# Altium schematic sheet MonitorOut.SchDoc
size A
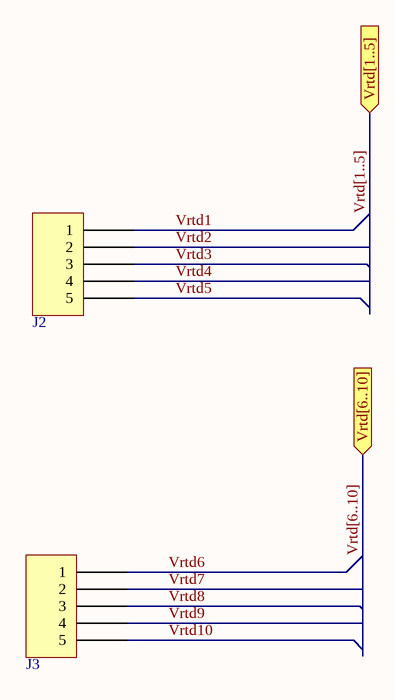
[diagram p0: MonitorOut.SchDoc]

## Parts
J2  0022272051  [MOLEX KK 0022272051]  (value not drawn)
J3  0022272051  [MOLEX KK 0022272051]  (value not drawn)

## Ports
Vrtd[1..5] (in), Vrtd[6..10] (in)

## Nets
Vrtd1: J2.1  [also labelled Vrtd[1..5]]
Vrtd2: J2.2
Vrtd3: J2.3
Vrtd4: J2.4
Vrtd5: J2.5
Vrtd6: J3.1  [also labelled Vrtd[6..10]]
Vrtd7: J3.2
Vrtd8: J3.3
Vrtd9: J3.4
Vrtd10: J3.5

## Library data of the parts
J2 J3 = 0022272051: CONN HEADER 5POS .100 VERT TIN; Manufacturer: Molex, LLC; Pitch: 0.100" (2.54mm); Number Of Positions: 5; Part Number: 0022272051; PartId: 9722; Supplier 1: Digi-Key; Supplier Part Number 1: WM4114-ND; ComponentLink1Description: Datasheet; ComponentLink1URL: http://www.molex.com/pdm_docs/sd/022272051_sd.pdf; ComponentLink2Description: Digi-Key Listing; ComponentLink2URL: http://www.digikey.com/product-search/en?keywords=22-27-2051; Price: 0.44; Type: Header, Unshrouded; Contact Finish: Tin; Fastening Type: Friction Lock; Number Of Rows: 1; Colour: Natural; Series: KK 6410